# Altium schematic sheet Encoder.SchDoc: Encoder connector
size A4; DrawnBy: Grzegorz Gajoch; Address1: Grzegorz Gajoch; Address2: grzegorz@gajoch.pl; Revision: 1
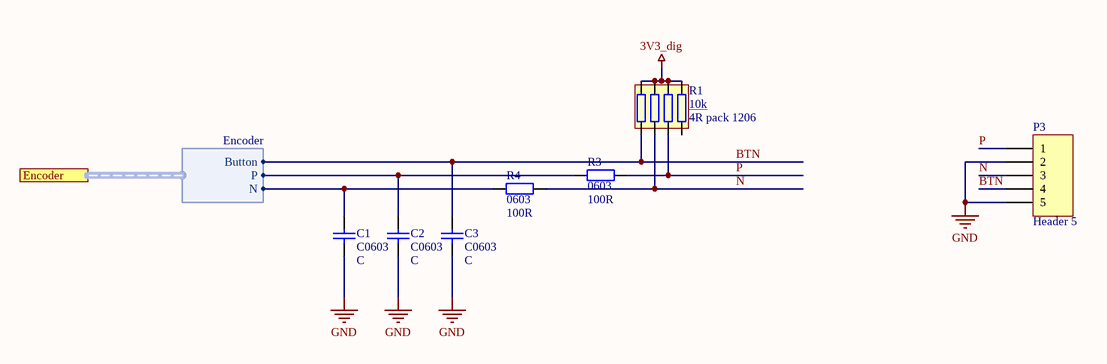
[diagram p0: Encoder.SchDoc]

## Parts
C1  C  [C0603]
C2  C  [C0603]
C3  C  [C0603]
P3  Header 5  [HDR1X5]
R1  10k  [4R pack 1206]
R3  100R  [0603]
R4  100R  [0603]

## Ports
Encoder (harness Encoder)

## Harnesses
Encoder: Button, P, N

## Nets
3V3_dig: R1.5 R1.6 R1.7 R1.8
GND: C1.2 C2.2 C3.2 P3.2 P3.5
BTN: C3.1 P3.4 R1.4 ; port Encoder.Button
N: P3.3 R1.3 R4.2
P: P3.1 R1.2 R3.2
NetC1_1: C1.1 R4.1 ; port Encoder.N
NetC2_1: C2.1 R3.1 ; port Encoder.P

Not connected (* = marked no-connect by the designer): R1 1

## Notes on the sheet
- Title
- Size:
- Date:
- A4
- Number:
- Time:
- Revision:
- Sheet
- of
- File:

## Library data of the parts
C1-C3 = Cap: Generic capacitor; Packge: C0603; Value: C
P3 = Header 5: Header, 5-Pin; LatestRevisionDate: 17-Jul-2002; LatestRevisionNote: Re-released for DXP Platform.; Publisher: Altium Limited
R1 = Rres_pack_4: 4 resistor pack array; Value: 10k; Package: 4R pack 1206
R3 R4 = Res: Generic resistor; Package: 0603; Value: 100R